# Altium project BLDC_BridgeBoard.PrjPcb (part 2 of 2)

## Sheet 6_Power.SchDoc
size A4; SheetNumber: 2; SheetTotal: 7
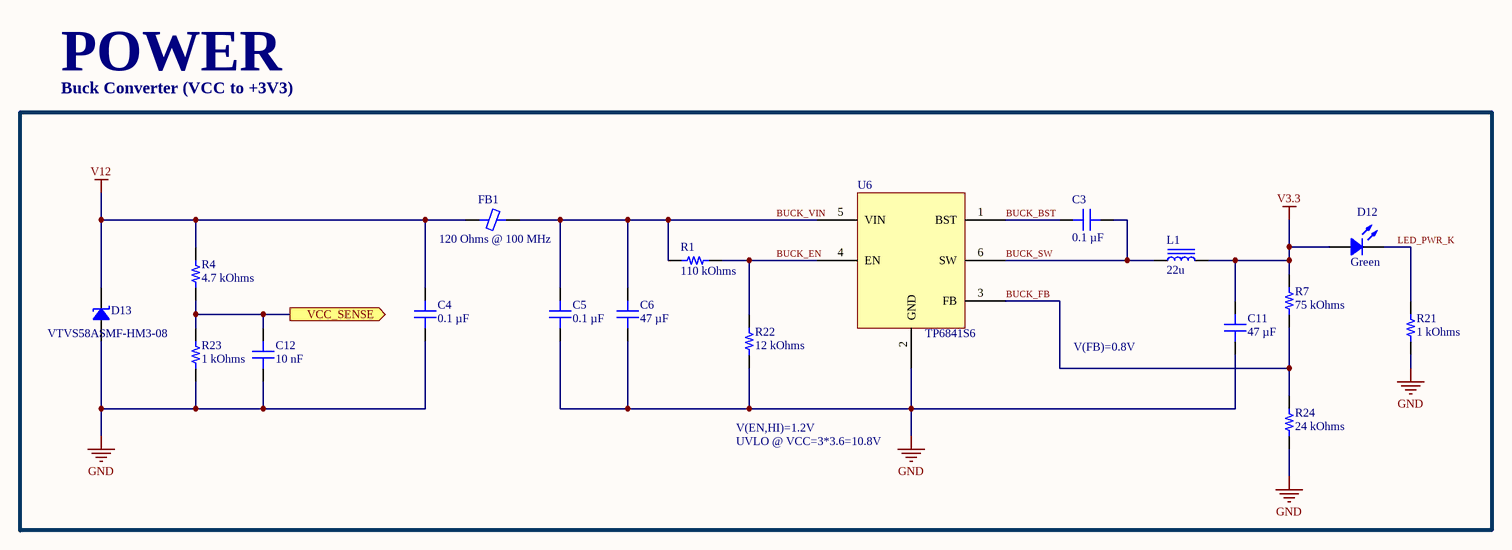
[diagram p6: 6_Power.SchDoc]

### Parts
C3  0.1 µF  [CAP 0805_2012]
C4  0.1 µF  [CAP 0805_2012]
C5  0.1 µF  [CAP 0805_2012]
C6  47 µF  [CAP 1210_3225 - 1MM]
C11  47 µF  [CAP 1210_3225 - 1MM]
C12  10 nF  [CAP 0805_2012]
D12  Green  [LED 0805_2012 GREEN]
D13  VTVS58ASMF-HM3-08  [SMF DO-219AB]
FB1  120 Ohms @ 100 MHz  [CAP 1812_4532 1.1MM]
L1  22u  [INDUCTOR_1R5]
R1  110 kOhms  [RES 0805_2012]
R4  4.7 kOhms  [RES 0805_2012]
R7  75 kOhms  [RES 0805_2012]
R21  1 kOhms  [RES 0805_2012]
R22  12 kOhms  [RES 0805_2012]
R23  1 kOhms  [RES 0805_2012]
R24  24 kOhms  [RES 0805_2012]
U6  TP6841S6  [SOT95P280X125-6M]

### Ports
VCC_SENSE (out)

### Nets
GND: C4.1 C5.1 C6.1 C11.1 C12.1 D13.1 R21.1 R22.1 R23.1 R24.1 U6.2(GND)
V3.3: C11.2 D12.1 L1.2 R7.2
V12: C4.2 D13.2 FB1.1 R4.2
BUCK_BST: C3.2 U6.1(BST)
BUCK_EN: R1.1 R22.2 U6.4(EN)
BUCK_FB: R7.1 R24.2 U6.3(FB)
BUCK_SW: C3.1 L1.1 U6.6(SW)
BUCK_VIN: C5.2 C6.2 FB1.2 R1.2 U6.5(VIN)
LED_PWR_K: D12.2 R21.2
VCC_SENSE: C12.2 R4.1 R23.2 ; port VCC_SENSE

### Notes on the sheet
- POWER
- Buck Converter (VCC to +3V3)
- V(FB)=0.8V
- V(EN,HI)=1.2V
- UVLO @ VCC=3*3.6=10.8V

### Library data of the parts
C3-C5 = CC0805MRX7R9BB104: CAP CER 0.1UF 50V X7R 0805; manufacturer: Yageo; Tolerance: ±20%; Part Number: CC0805MRX7R9BB104; Value: 0.1 µF; Applications: General Purpose; Capacitance: 0.1 µF; componentlink1description: Datasheet; componentlink1url: https://www.yageo.com/upload/media/product/productsearch/datasheet/mlcc/UPY-GPHC_X7R_6.3V-to-50V_18.pdf; componentlink2description: DigiKey Link; componentlink2url: https://www.digikey.com/en/products/detail/yageo/CC0805MRX7R9BB104/5884281; Device Package: 0805 (2012 Metric); lastupdated: 15/11/2023 20:14:20; Lifecycle Status: Active; Minimum Order: 1; Mounting Type: Surface Mount, MLCC; Operating Temperature: -55°C ~ 125°C; Package / Case: 0805 (2012 Metric); packaging: TapeAndReel; partid: 2475; Part Status: Active; price: 0.01; series: CC; Size / Dimension: 0.079" L x 0.049" W (2.00mm x 1.25mm); Supplier 1: DigiKey; Supplier Part Number 1: 311-4351-1-ND; Temperature Coefficient: X7R; Thickness (Max): 0.037" (0.95mm); Voltage - Rated: 50V
C6 C11 = GRM32EC81C476KE15L: CAP CER 47UF 16V X6S 1210; manufacturer: Murata Electronics; Tolerance: ±10%; Part Number: GRM32EC81C476KE15L; Value: 47 µF; Applications: General Purpose; Capacitance: 47 µF; componentlink1description: Datasheet; componentlink1url: https://search.murata.co.jp/Ceramy/image/img/A01X/G101/ENG/GRM32EC81C476KE15-01.pdf; componentlink2description: DigiKey Link; componentlink2url: https://www.digikey.com/en/products/detail/murata-electronics/GRM32EC81C476KE15L/5027615; Device Package: 1210 (3225 Metric); lastupdated: 11/03/2024 7:20:02; Lifecycle Status: Active; Minimum Order: 1; Mounting Type: Surface Mount, MLCC; Operating Temperature: -55°C ~ 105°C; Package / Case: 1210 (3225 Metric); packaging: TapeAndReel; partid: 23627; Part Status: Active; price: 0.12; series: GRM; Size / Dimension: 0.126" L x 0.098" W (3.20mm x 2.50mm); Supplier 1: DigiKey; Supplier Part Number 1: 490-10531-1-ND; Temperature Coefficient: X6S; Thickness (Max): 0.106" (2.70mm); Voltage - Rated: 16V
C12 = C0805X103K1RAC3316: CAP CER 0805 10NF 100V X7R; manufacturer: KEMET; Capacitance: 10000 pF; Tolerance: ±10%; Part Number: C0805X103K1RAC3316; Value: 10 nF; Applications: Automotive, Boardflex Sensitive; componentlink1description: Datasheet; componentlink1url: https://api.kemet.com/component-edge/download/datasheet/C0805X103K1RAC3316.pdf; componentlink2description: DigiKey Link; componentlink2url: https://www.digikey.com/en/products/detail/kemet/C0805X103K1RAC3316/10315780; Device Package: 0805 (2012 Metric); Features: Soft Termination; lastupdated: 09/02/2024 20:16:09; Lifecycle Status: Active; Minimum Order: 1; Mounting Type: Surface Mount, MLCC; Operating Temperature: -55°C ~ 125°C; Package / Case: 0805 (2012 Metric); packaging: TapeAndReel; partid: 2565; Part Status: Active; price: 0.02; Ratings: AEC-Q200; series: SMD Auto X7R VW80808; Size / Dimension: 0.079" L x 0.049" W (2.00mm x 1.25mm); Supplier 1: DigiKey; Supplier Part Number 1: 399-C0805X103K1RAC3316CT-ND; Temperature Coefficient: X7R; Thickness (Max): 0.039" (0.98mm); Voltage - Rated: 100V
D12 = SM0805UGC: LED GREEN CLEAR 0805 SMD; Manufacturer: Bivar Inc.; Configuration: Standard; Current - Test: 20mA; Lens Color: Colorless; Lens Size: 1.40mm x 1.20mm; Lens Style: Rectangle with Flat Top; Millicandela Rating: 10mcd; Viewing Angle: 130°; Voltage - Forward (Vf) (Typ): 2V; Wavelength - Dominant: 565nm; Wavelength - Peak: 563nm; Part Number: SM0805UGC; Color: Green; ComponentLink1Description: Datasheet; ComponentLink1URL: https://www.bivar.com/Files/Datasheets/SM0805UGC.pdf; ComponentLink2Description: DigiKey Link; ComponentLink2URL: https://www.digikey.com/en/products/detail/bivar-inc/SM0805UGC/2408549; Device Package: 0805 (2012 Metric); Height (Max): 1.10mm; LastUpdated: 11/03/2024 7:52:46; Lens Transparency: Clear; Lifecycle Status: Active; Minimum Order: 1; Mounting Type: Surface Mount; Package / Case: 0805 (2012 Metric); Packaging: TapeAndReel; PartId: 247; Part Status: Active; Price: 0.19; Series: -; Size / Dimension: 2.00mm L x 1.20mm W; Supplier 1: DigiKey; Supplier Part Number 1: 492-1329-1-ND; Supplier Device Package: 0805; Value: Green
D13 = VTVS58ASMF-HM3-08: TVS DIODE 57.6V 98V DO219AB; Manufacturer: Vishay Semiconductor Diodes Division; Capacitance @ Frequency: 245pF @ 1MHz; Current - Peak Pulse (10/1000µs): 3.89A; Power Line Protection: No; Power - Peak Pulse: 400W; Type: DO-219AB; Unidirectional Channels: 1; Voltage - Breakdown (Min): 64.6V; Part Number: VTVS58ASMF-HM3-08; Applications: Automotive; ComponentLink1Description: Datasheet; ComponentLink1URL: http://www.vishay.com/docs/85891/vtvs3v3asmf.pdf; ComponentLink2Description: DigiKey Link; ComponentLink2URL: http://digikey.com/product-detail/en/vishay-semiconductor-diodes-division/VTVS58ASMF-HM3-08/112-VTVS58ASMF-HM3-08CT-ND/11562600; LastUpdated: 11/03/2024 8:09:28; Lifecycle Status: Active; Minimum Order: 0; Mounting Type: Surface Mount; Operating Temperature: -55°C ~ 175°C (TJ); Package / Case: DO-219AB; Packaging: TapeAndReel; PartId: 5476; Part Status: -55°C ~ 175°C (TJ); Price: 0.10; Series: Automotive, AEC-Q101, TransZorb®; Supplier 1: DigiKey; Supplier Part Number 1: 112-VTVS58ASMF-HM3-08CT-ND; Supplier Device Package: DO-219AB (SMF); Voltage - Clamping (Max) @ Ipp: 98V; Voltage - Reverse Standoff (Typ): 57.6V
FB1 = Ferrite Chip 1812: SMT Ferrite Chip
L1 = Inductor: SMT Inductor; Value: 22u
R1 = CRCW0805110KFKEA: RES SMD 110K OHM 1% 1/8W 0805; Manufacturer: Vishay Dale; Power (Watts): 0.125W, 1/8W; Temperature Coefficient: ±100ppm/°C; Part Number: CRCW0805110KFKEA; Value: 110 kOhms; ComponentLink1Description: Datasheet; ComponentLink1URL: http://www.vishay.com/docs/20035/dcrcwe3.pdf; ComponentLink2Description: DigiKey Link; ComponentLink2URL: https://www.digikey.com/en/products/detail/vishay-dale/CRCW0805110KFKEA/1175869; Composition: Thick Film; Device Package: 0805 (2012 Metric); Features: Automotive AEC-Q200; Height - Seated (Max): 0.020" (0.50mm); LastUpdated: 08/02/2024 21:02:11; Lifecycle Status: Active; Minimum Order: 1; Number of Terminations: 2; Operating Temperature: -55°C ~ 155°C; Package / Case: 0805 (2012 Metric); Packaging: TapeAndReel; PartId: 34096; Part Status: Active; Price: 0.01; Ratings: AEC-Q200; Resistance: 110 kOhms; Series: CRCW; Size / Dimension: 0.079" L x 0.049" W (2.00mm x 1.25mm); Supplier 1: DigiKey; Supplier Part Number 1: 541-110KCCT-ND; Supplier Device Package: 0805; Tolerance: ±1%
R4 = RCS08054K70JNEA: RES SMD 4.7K OHM 5% 1/2W 0805; Manufacturer: Vishay Dale; Power (Watts): 0.5W, 1/2W; Temperature Coefficient: ±200ppm/°C; Part Number: RCS08054K70JNEA; Value: 4.7 kOhms; ComponentLink1Description: Datasheet; ComponentLink1URL: http://www.vishay.com/docs/20065/rcse3.pdf; ComponentLink2Description: DigiKey Link; ComponentLink2URL: https://www.digikey.com/en/products/detail/vishay-dale/RCS08054K70JNEA/5867012; Composition: Thick Film; Device Package: 0805 (2012 Metric); Features: Automotive AEC-Q200, Pulse Withstanding; Height - Seated (Max): 0.020" (0.50mm); LastUpdated: 08/02/2024 21:02:38; Lifecycle Status: Active; Minimum Order: 1; Number of Terminations: 2; Operating Temperature: -55°C ~ 155°C; Package / Case: 0805 (2012 Metric); Packaging: TapeAndReel; PartId: 27839; Part Status: Active; Price: 0.02; Ratings: AEC-Q200; Resistance: 4.7 kOhms; Series: RCS e3; Size / Dimension: 0.079" L x 0.049" W (2.00mm x 1.25mm); Supplier 1: DigiKey; Supplier Part Number 1: 541-2866-1-ND; Supplier Device Package: 0805; Tolerance: ±5%
R7 = RT0805DRD0775KL: RES SMD 75K OHM 0.5% 1/8W 0805; Manufacturer: Yageo; Power (Watts): 0.125W, 1/8W; Temperature Coefficient: ±25ppm/°C; Part Number: RT0805DRD0775KL; Value: 75 kOhms; ComponentLink1Description: Datasheet; ComponentLink1URL: https://www.yageo.com/upload/media/product/productsearch/datasheet/rchip/PYu-RT_1-to-0.01_RoHS_L_11.pdf; ComponentLink2Description: DigiKey Link; ComponentLink2URL: https://www.digikey.com/en/products/detail/yageo/RT0805DRD0775KL/1078303; Composition: Thin Film; Device Package: 0805 (2012 Metric); Height - Seated (Max): 0.024" (0.60mm); LastUpdated: 08/02/2024 21:02:28; Lifecycle Status: Active; Minimum Order: 1; Number of Terminations: 2; Operating Temperature: -55°C ~ 155°C; Package / Case: 0805 (2012 Metric); Packaging: TapeAndReel; PartId: 30296; Part Status: Active; Price: 0.02; Resistance: 75 kOhms; Series: RT; Size / Dimension: 0.079" L x 0.049" W (2.00mm x 1.25mm); Supplier 1: DigiKey; Supplier Part Number 1: 311-2766-1-ND; Supplier Device Package: 0805; Tolerance: ±0.5%
R21 R23 = CR0805-JW-204ELF: RES SMD 200K OHM 5% 1/8W 0805; Manufacturer: Bourns Inc.; Power (Watts): 0.125W, 1/8W; Resistance: 200 kOhms; Temperature Coefficient: ±200ppm/°C; Part Number: CR0805-JW-204ELF; Value: 1 kOhms; ComponentLink1Description: Datasheet; ComponentLink1URL: https://www.bourns.com/docs/product-datasheets/cr.pdf?sfvrsn=574d41f6_14; ComponentLink2Description: DigiKey Link; ComponentLink2URL: https://www.digikey.com/en/products/detail/bourns-inc/CR0805-JW-204ELF/3785267; Composition: Thick Film; Device Package: 0805 (2012 Metric); Features: Moisture Resistant; Height - Seated (Max): 0.024" (0.60mm); LastUpdated: 02/11/2023 20:02:13; Lifecycle Status: Active; Minimum Order: 1; Number of Terminations: 2; Operating Temperature: -55°C ~ 155°C; Package / Case: 0805 (2012 Metric); Packaging: TapeAndReel; PartId: 69673; Part Status: Active; Price: 0.01; Series: CR0805; Size / Dimension: 0.079" L x 0.049" W (2.00mm x 1.25mm); Supplier 1: DigiKey; Supplier Part Number 1: 118-CR0805-JW-204ELFCT-ND; Supplier Device Package: 0805; Tolerance: ±5%
R22 = CRGP0805F12K: RES 12K OHM 1% 1/3W 0805; Manufacturer: TE Connectivity Passive Product; Power (Watts): 0.333W, 1/3W; Temperature Coefficient: ±100ppm/°C; Part Number: CRGP0805F12K; Value: 12 kOhms; ComponentLink1Description: Datasheet; ComponentLink1URL: https://www.te.com/commerce/DocumentDelivery/DDEController?Action=srchrtrv&DocNm=9-1773463-9&DocType=DS&DocLang=English; ComponentLink2Description: DigiKey Link; ComponentLink2URL: https://www.digikey.com/en/products/detail/te-connectivity-passive-product/CRGP0805F12K/8577092; Composition: Thick Film; Device Package: 0805 (2012 Metric); Features: Pulse Withstanding; Height - Seated (Max): 0.026" (0.65mm); LastUpdated: 08/02/2024 21:02:34; Lifecycle Status: Active; Minimum Order: 1; Number of Terminations: 2; Operating Temperature: -55°C ~ 155°C; Package / Case: 0805 (2012 Metric); Packaging: TapeAndReel; PartId: 28729; Part Status: Active; Price: 0.02; Resistance: 12 kOhms; Series: CRGP; Size / Dimension: 0.079" L x 0.049" W (2.00mm x 1.25mm); Supplier 1: DigiKey; Supplier Part Number 1: A130490CT-ND; Supplier Device Package: 0805; Tolerance: ±1%
R24 = CRG0805F24K: RES SMD 24K OHM 1% 1/8W 0805; Manufacturer: TE Connectivity Passive Product; Power (Watts): 0.125W, 1/8W; Temperature Coefficient: ±100ppm/°C; Part Number: CRG0805F24K; Value: 24 kOhms; ComponentLink1Description: Datasheet; ComponentLink1URL: https://www.te.com/commerce/DocumentDelivery/DDEController?Action=srchrtrv&DocNm=1773204&DocType=DS&DocLang=English; ComponentLink2Description: DigiKey Link; ComponentLink2URL: https://www.digikey.com/en/products/detail/te-connectivity-passive-product/CRG0805F24K/2380875; Composition: Thick Film; Device Package: 0805 (2012 Metric); Height - Seated (Max): 0.026" (0.65mm); LastUpdated: 08/02/2024 21:02:08; Lifecycle Status: Active; Minimum Order: 1; Number of Terminations: 2; Operating Temperature: -55°C ~ 155°C; Package / Case: 0805 (2012 Metric); Packaging: TapeAndReel; PartId: 34700; Part Status: Active; Price: 0.01; Resistance: 24 kOhms; Series: CRG, Neohm; Size / Dimension: 0.079" L x 0.049" W (2.00mm x 1.25mm); Supplier 1: DigiKey; Supplier Part Number 1: A126353CT-ND; Supplier Device Package: 0805; Tolerance: ±1%
U6 = TP6841S6: TP6841S6 Power Supply. 4.5 to 40 V input voltage. Up to 800 mA output current.; ComponentLink1Description: New link; ComponentLink1URL: *

## Nets that join several sheets
GND: 1_FET_A (10 pins), 2_FET_B (10 pins), 4_Connectors (10 pins), 5_ZeroCrossingDetector (16 pins), 6_Power (11 pins)
V3.3: 1_FET_A (C7.1 U1.5), 2_FET_B (C15.1 U2.5), 4_Connectors (P4.2), 5_ZeroCrossingDetector (6 pins), 6_Power (C11.2 D12.1 L1.2 R7.2)
V12: 1_FET_A (10 pins), 2_FET_B (10 pins), 3_FET_C (10 pins), 4_Connectors (P2.2), 6_Power (C4.2 D13.2 FB1.1 R4.2)
PHA: 1_FET_A (13 pins), 5_ZeroCrossingDetector (R11.1)
PHA_A_ADC: 1_FET_A (C8.1 D10.2 R2.2), 4_Connectors (P1.2 P4.9)
PHA_B_ADC: 2_FET_B (C16.1 D11.2 R5.1), 4_Connectors (P1.1 P4.10)
PHB: 2_FET_B (13 pins), 5_ZeroCrossingDetector (R13.1)
PHC: 3_FET_C (13 pins), 5_ZeroCrossingDetector (R15.1)
PWM1_A: 1_FET_A (U7.2), 4_Connectors (P1.8 P4.20)
PWM1_B: 1_FET_A (U7.3), 4_Connectors (P1.7 P4.19)
PWM2_A: 2_FET_B (U8.2), 4_Connectors (P1.6 P4.17)
PWM2_B: 2_FET_B (U8.3), 4_Connectors (P1.5 P4.16)
PWM3_A: 3_FET_C (U9.2), 4_Connectors (P1.4 P4.14)
PWM3_B: 3_FET_C (U9.3), 4_Connectors (P1.3 P4.15)
VCC_SENSE: 4_Connectors (P1.12 P4.7), 6_Power (C12.2 R4.1 R23.2)
ZCD_PHV_U: 4_Connectors (P1.15 P4.12), 5_ZeroCrossingDetector (R9.1 U3.4)
ZCD_PHV_V: 4_Connectors (P1.14 P4.6), 5_ZeroCrossingDetector (R19.1 U4.4)
ZCD_PHV_W: 4_Connectors (P1.13 P4.4), 5_ZeroCrossingDetector (R20.1 U5.4)